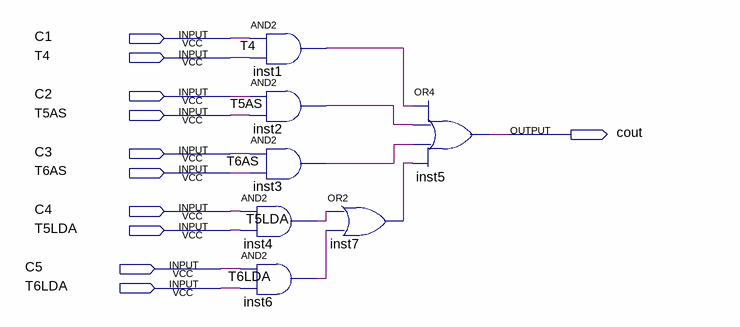
[diagram p0: schematic sheet]
// Quartus schematic mux.bdf as structural Verilog: 7 symbols, 11 pins
module mux (
  input  C1,
  input  T4,
  input  C2,
  input  T5AS,
  input  C3,
  input  T6AS,
  input  C4,
  input  T5LDA,
  input  C5,
  input  T6LDA,
  output cout
);

  wire inst1_out, inst2_out, inst3_out, inst4_out, inst6_out, inst7_out;

  and inst1 (inst1_out, C1, T4);
  and inst2 (inst2_out, C2, T5AS);
  and inst3 (inst3_out, C3, T6AS);
  and inst4 (inst4_out, C4, T5LDA);
  and inst6 (inst6_out, C5, T6LDA);
  or inst7 (inst7_out, inst4_out, inst6_out);
  or inst5 (cout, inst1_out, inst2_out, inst3_out, inst7_out);
endmodule
